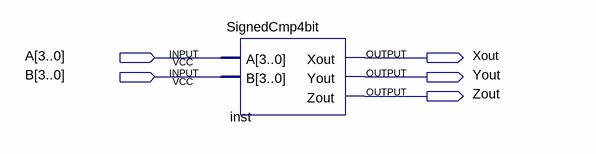
[diagram p0: schematic sheet]
// Quartus schematic SignedCmpDemo.bdf as structural Verilog: 1 symbols, 5 pins
module SignedCmpDemo (
  input  [3:0] A,
  input  [3:0] B,
  output Xout,
  output Yout,
  output Zout
);

  SignedCmp4bit inst (.A(A), .B(B), .Xout(Xout), .Yout(Yout), .Zout(Zout));
endmodule
